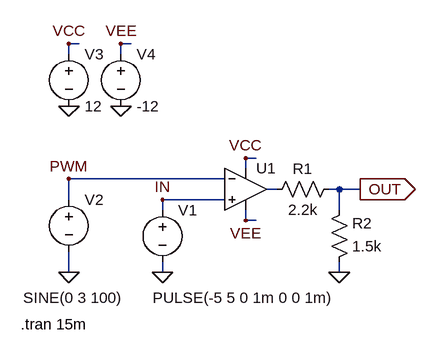
[diagram p0: schematic Saw2Sqr_PWM.asc]
Saw2Sqr_PWM.asc, the LTspice schematic file:
Version 4
SHEET 1 880 680
WIRE -16 -80 -32 -80
WIRE 64 -80 48 -80
WIRE -32 -64 -32 -80
WIRE 48 -64 48 -80
WIRE 256 96 240 96
WIRE 240 112 240 96
WIRE 208 128 -32 128
WIRE 288 144 272 144
WIRE 384 144 368 144
WIRE 416 144 384 144
WIRE -32 160 -32 128
WIRE 208 160 112 160
WIRE 112 176 112 160
WIRE 384 176 384 144
WIRE 240 192 240 176
WIRE 256 192 240 192
WIRE -32 272 -32 240
WIRE 112 272 112 256
WIRE 384 272 384 256
FLAG 240 96 VCC
FLAG 240 192 VEE
FLAG 112 272 0
FLAG 384 272 0
FLAG 416 144 OUT
IOPIN 416 144 Out
FLAG -32 272 0
FLAG -32 16 0
FLAG 48 16 0
FLAG -32 -80 VCC
FLAG 48 -80 VEE
FLAG -32 128 PWM
FLAG 112 160 IN
SYMBOL Opamps\\UniversalOpamp2 240 144 R0
SYMATTR InstName U1
SYMBOL voltage 112 160 R0
WINDOW 3 -15 151 Left 2
WINDOW 123 0 0 Left 0
WINDOW 39 0 0 Left 0
SYMATTR InstName V1
SYMATTR Value PULSE(-5 5 0 1m 0 0 1m)
SYMBOL res 384 128 R90
WINDOW 0 0 56 VBottom 2
WINDOW 3 32 56 VTop 2
SYMATTR InstName R1
SYMATTR Value 2.2k
SYMBOL res 368 272 M180
WINDOW 0 36 76 Left 2
WINDOW 3 36 40 Left 2
SYMATTR InstName R2
SYMATTR Value 1.5k
SYMBOL voltage -32 144 R0
WINDOW 3 -70 167 Left 2
WINDOW 123 0 0 Left 0
WINDOW 39 0 0 Left 0
SYMATTR InstName V2
SYMATTR Value SINE(0 3 100)
SYMBOL voltage -32 -80 R0
WINDOW 123 0 0 Left 0
WINDOW 39 0 0 Left 0
SYMATTR InstName V3
SYMATTR Value 12
SYMBOL voltage 48 -80 R0
WINDOW 123 0 0 Left 0
WINDOW 39 0 0 Left 0
SYMATTR InstName V4
SYMATTR Value -12
TEXT -106 352 Left 2 !.tran 15m

The netlist it stands for:
* Saw2Sqr_PWM.asc
XU1 IN PWM VCC VEE N001 level.2 Avol=1Meg GBW=10Meg Slew=10Meg ilimit=25m rail=0 Vos=0 phimargin=45 en=0 enk=0 in=0 ink=0 Rin=500Meg  ; pins IN+ IN- V+ V- OUT
V1 IN 0 PULSE(-5 5 0 1m 0 0 1m)
R1 OUT N001 2.2k
R2 0 OUT 1.5k
V2 PWM 0 SINE(0 3 100)
V3 VCC 0 12
V4 VEE 0 -12
.tran 15m
.lib UniversalOpamps2.sub
.backanno
.end